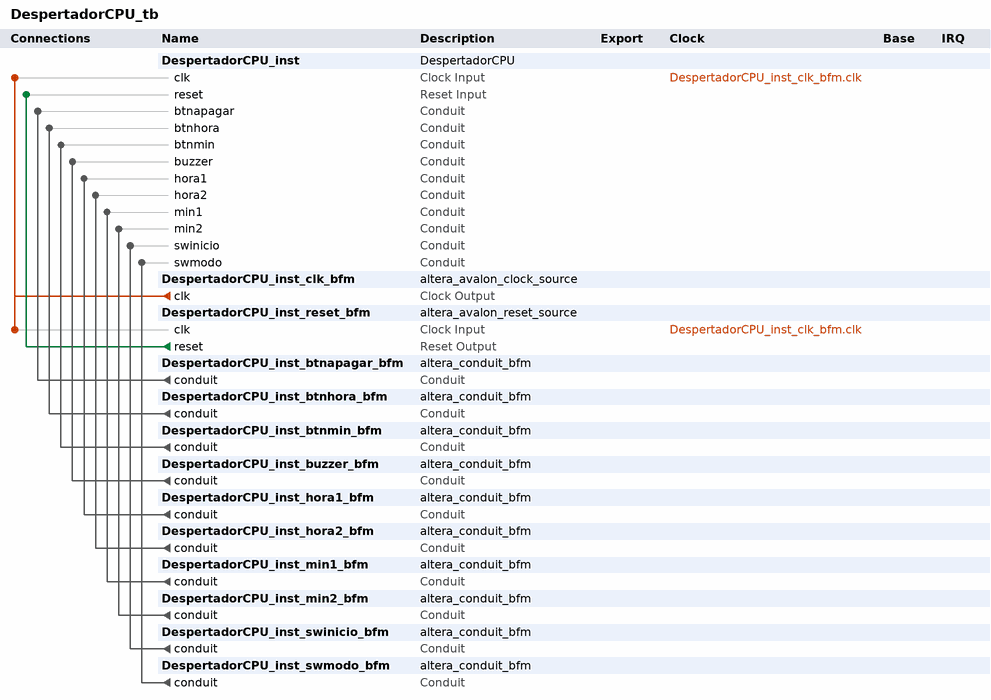
[diagram p0: system contents]
# Platform Designer (Qsys) system DespertadorCPU_tb, Cyclone V 5CSEMA5F31C6
# Parameters at their usual value, and those the tool derives, are not listed.
package require -exact qsys 18.1
create_system DespertadorCPU_tb
set_project_property DEVICE_FAMILY {Cyclone V}
set_project_property DEVICE 5CSEMA5F31C6

add_instance DespertadorCPU_inst DespertadorCPU 1.0

add_instance DespertadorCPU_inst_clk_bfm altera_avalon_clock_source 18.1

add_instance DespertadorCPU_inst_reset_bfm altera_avalon_reset_source 18.1
set_instance_parameter_value DespertadorCPU_inst_reset_bfm ASSERT_HIGH_RESET 0
set_instance_parameter_value DespertadorCPU_inst_reset_bfm INITIAL_RESET_CYCLES 50

add_instance DespertadorCPU_inst_btnapagar_bfm altera_conduit_bfm 18.1
set_instance_parameter_value DespertadorCPU_inst_btnapagar_bfm CLOCKED_SIGNAL false
set_instance_parameter_value DespertadorCPU_inst_btnapagar_bfm ENABLE_RESET false
set_instance_parameter_value DespertadorCPU_inst_btnapagar_bfm SIGNAL_DIRECTIONS output
set_instance_parameter_value DespertadorCPU_inst_btnapagar_bfm SIGNAL_WIDTHS 1

add_instance DespertadorCPU_inst_btnhora_bfm altera_conduit_bfm 18.1
set_instance_parameter_value DespertadorCPU_inst_btnhora_bfm CLOCKED_SIGNAL false
set_instance_parameter_value DespertadorCPU_inst_btnhora_bfm ENABLE_RESET false
set_instance_parameter_value DespertadorCPU_inst_btnhora_bfm SIGNAL_DIRECTIONS output
set_instance_parameter_value DespertadorCPU_inst_btnhora_bfm SIGNAL_WIDTHS 1

add_instance DespertadorCPU_inst_btnmin_bfm altera_conduit_bfm 18.1
set_instance_parameter_value DespertadorCPU_inst_btnmin_bfm CLOCKED_SIGNAL false
set_instance_parameter_value DespertadorCPU_inst_btnmin_bfm ENABLE_RESET false
set_instance_parameter_value DespertadorCPU_inst_btnmin_bfm SIGNAL_DIRECTIONS output
set_instance_parameter_value DespertadorCPU_inst_btnmin_bfm SIGNAL_WIDTHS 1

add_instance DespertadorCPU_inst_buzzer_bfm altera_conduit_bfm 18.1
set_instance_parameter_value DespertadorCPU_inst_buzzer_bfm CLOCKED_SIGNAL false
set_instance_parameter_value DespertadorCPU_inst_buzzer_bfm ENABLE_RESET false
set_instance_parameter_value DespertadorCPU_inst_buzzer_bfm SIGNAL_DIRECTIONS input
set_instance_parameter_value DespertadorCPU_inst_buzzer_bfm SIGNAL_WIDTHS 1

add_instance DespertadorCPU_inst_hora1_bfm altera_conduit_bfm 18.1
set_instance_parameter_value DespertadorCPU_inst_hora1_bfm CLOCKED_SIGNAL false
set_instance_parameter_value DespertadorCPU_inst_hora1_bfm ENABLE_RESET false
set_instance_parameter_value DespertadorCPU_inst_hora1_bfm SIGNAL_DIRECTIONS input
set_instance_parameter_value DespertadorCPU_inst_hora1_bfm SIGNAL_WIDTHS 7

add_instance DespertadorCPU_inst_hora2_bfm altera_conduit_bfm 18.1
set_instance_parameter_value DespertadorCPU_inst_hora2_bfm CLOCKED_SIGNAL false
set_instance_parameter_value DespertadorCPU_inst_hora2_bfm ENABLE_RESET false
set_instance_parameter_value DespertadorCPU_inst_hora2_bfm SIGNAL_DIRECTIONS input
set_instance_parameter_value DespertadorCPU_inst_hora2_bfm SIGNAL_WIDTHS 7

add_instance DespertadorCPU_inst_min1_bfm altera_conduit_bfm 18.1
set_instance_parameter_value DespertadorCPU_inst_min1_bfm CLOCKED_SIGNAL false
set_instance_parameter_value DespertadorCPU_inst_min1_bfm ENABLE_RESET false
set_instance_parameter_value DespertadorCPU_inst_min1_bfm SIGNAL_DIRECTIONS input
set_instance_parameter_value DespertadorCPU_inst_min1_bfm SIGNAL_WIDTHS 7

add_instance DespertadorCPU_inst_min2_bfm altera_conduit_bfm 18.1
set_instance_parameter_value DespertadorCPU_inst_min2_bfm CLOCKED_SIGNAL false
set_instance_parameter_value DespertadorCPU_inst_min2_bfm ENABLE_RESET false
set_instance_parameter_value DespertadorCPU_inst_min2_bfm SIGNAL_DIRECTIONS input
set_instance_parameter_value DespertadorCPU_inst_min2_bfm SIGNAL_WIDTHS 7

add_instance DespertadorCPU_inst_swinicio_bfm altera_conduit_bfm 18.1
set_instance_parameter_value DespertadorCPU_inst_swinicio_bfm CLOCKED_SIGNAL false
set_instance_parameter_value DespertadorCPU_inst_swinicio_bfm ENABLE_RESET false
set_instance_parameter_value DespertadorCPU_inst_swinicio_bfm SIGNAL_DIRECTIONS output
set_instance_parameter_value DespertadorCPU_inst_swinicio_bfm SIGNAL_WIDTHS 1

add_instance DespertadorCPU_inst_swmodo_bfm altera_conduit_bfm 18.1
set_instance_parameter_value DespertadorCPU_inst_swmodo_bfm CLOCKED_SIGNAL false
set_instance_parameter_value DespertadorCPU_inst_swmodo_bfm ENABLE_RESET false
set_instance_parameter_value DespertadorCPU_inst_swmodo_bfm SIGNAL_DIRECTIONS output
set_instance_parameter_value DespertadorCPU_inst_swmodo_bfm SIGNAL_WIDTHS 1

# connections
add_connection DespertadorCPU_inst_clk_bfm.clk DespertadorCPU_inst.clk clock
add_connection DespertadorCPU_inst_clk_bfm.clk DespertadorCPU_inst_reset_bfm.clk clock
add_connection DespertadorCPU_inst_reset_bfm.reset DespertadorCPU_inst.reset reset
add_connection DespertadorCPU_inst_btnapagar_bfm.conduit DespertadorCPU_inst.btnapagar conduit
add_connection DespertadorCPU_inst_btnhora_bfm.conduit DespertadorCPU_inst.btnhora conduit
add_connection DespertadorCPU_inst_btnmin_bfm.conduit DespertadorCPU_inst.btnmin conduit
add_connection DespertadorCPU_inst_buzzer_bfm.conduit DespertadorCPU_inst.buzzer conduit
add_connection DespertadorCPU_inst_hora1_bfm.conduit DespertadorCPU_inst.hora1 conduit
add_connection DespertadorCPU_inst_hora2_bfm.conduit DespertadorCPU_inst.hora2 conduit
add_connection DespertadorCPU_inst_min1_bfm.conduit DespertadorCPU_inst.min1 conduit
add_connection DespertadorCPU_inst_min2_bfm.conduit DespertadorCPU_inst.min2 conduit
add_connection DespertadorCPU_inst_swinicio_bfm.conduit DespertadorCPU_inst.swinicio conduit
add_connection DespertadorCPU_inst_swmodo_bfm.conduit DespertadorCPU_inst.swmodo conduit

set_interconnect_requirement {$system} qsys_mm.clockCrossingAdapter HANDSHAKE
set_interconnect_requirement {$system} qsys_mm.enableEccProtection FALSE
set_interconnect_requirement {$system} qsys_mm.insertDefaultSlave FALSE
set_interconnect_requirement {$system} qsys_mm.maxAdditionalLatency 1

save_system DespertadorCPU_tb.qsys
